# EAGLE design operator_mk2 (EAGLE 7.1.0)
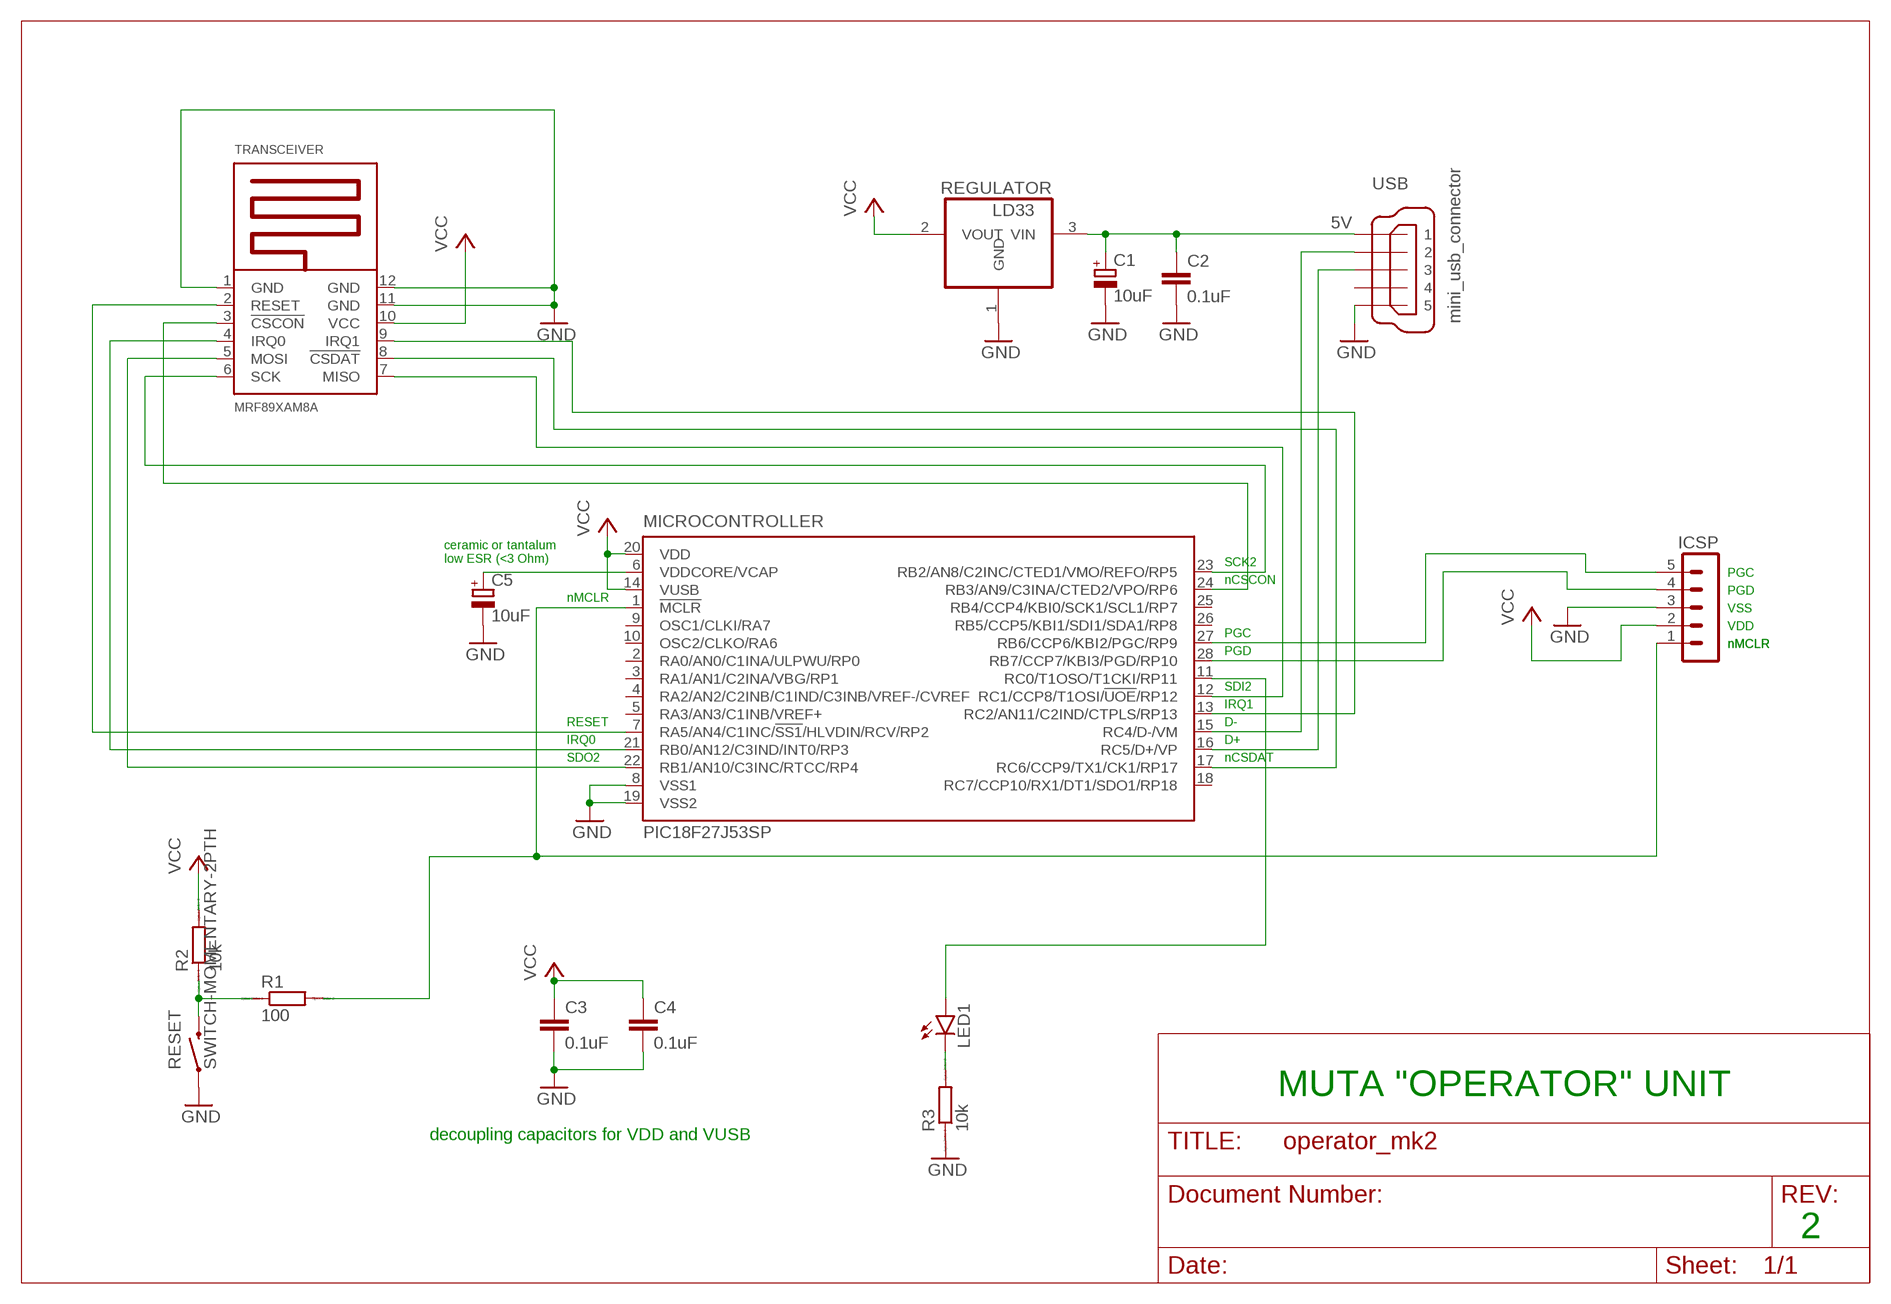
[diagram p0: schematic, sheet 1]

## Parts
C1  10uF  CPOL-EUTT6D6  [TT5D6]
C2  0.1uF  C-EU050-025X075  [C050-025X075]
C3  0.1uF  C-EU050-025X075  [C050-025X075]
C4  0.1uF  C-EU050-025X075  [C050-025X075]
C5  10uF  CPOL-EUC/6032-28R  [C/6032-28R]
ICSP  MA05-1  [MA05-1]
LED1  LED5MM  [LED5MM]
MICROCONTROLLER  PIC18F27J53SP  [DIL28-3]
R1  100  R-EU_0207_10  [0207/10]
R2  10k  R-EU_0207_10  [0207/10]
R3  10k  R-EU_0207_2V  [0207/2V]
REGULATOR  LD33  REG1117  [SOT223]
RESET  SWITCH-MOMENTARY-2PTH  [TACTILE-PTH]
TRANSCEIVER  MRF89XAM8A  [MRF89XAMXA]
USB  mini_usb_connector  MINI-USB-UX60-MB-5ST  [UX60-MB-5ST]

## Nets
5V: C1.+ C2.1 REGULATOR.3(VIN) USB.1
GND: C1.- C2.2 C3.2 C4.2 C5.- ICSP.3 MICROCONTROLLER.8(VSS1) MICROCONTROLLER.19(VSS2) R3.1 REGULATOR.1(GND) RESET.1 TRANSCEIVER.1(GND) TRANSCEIVER.11(GND) TRANSCEIVER.12(GND) USB.5
N$1: MICROCONTROLLER.15(RC4/D-/VM) USB.2
N$2: MICROCONTROLLER.16(RC5/D+/VP) USB.3
N$3: ICSP.1 MICROCONTROLLER.1(!MCLR) R1.2
N$4: C5.+ MICROCONTROLLER.6(VDDCORE/VCAP)
N$5: R1.1 R2.1 RESET.3
N$6: ICSP.4 MICROCONTROLLER.28(RB7/CCP7/KBI3/PGD/RP10)
N$7: ICSP.5 MICROCONTROLLER.27(RB6/CCP6/KBI2/PGC/RP9)
N$9: MICROCONTROLLER.7(RA5/AN4/C1INC/!SS1!/HLVDIN/RCV/RP2) TRANSCEIVER.2(RESET)
N$10: MICROCONTROLLER.23(RB2/AN8/C2INC/CTED1/VMO/REFO/RP5) TRANSCEIVER.6(SCK)
N$14: LED1.K(C) R3.2
N$15: LED1.A MICROCONTROLLER.11(RC0/T1OSO/T1CKI/RP11)
N$19: MICROCONTROLLER.12(RC1/CCP8/T1OSI/!UOE!/RP12) TRANSCEIVER.7(MISO)
N$21: MICROCONTROLLER.24(RB3/AN9/C3INA/CTED2/VPO/RP6) TRANSCEIVER.3(!CSCON)
N$22: MICROCONTROLLER.22(RB1/AN10/C3INC/RTCC/RP4) TRANSCEIVER.5(MOSI)
N$23: MICROCONTROLLER.21(RB0/AN12/C3IND/INT0/RP3) TRANSCEIVER.4(IRQ0)
N$24: MICROCONTROLLER.13(RC2/AN11/C2IND/CTPLS/RP13) TRANSCEIVER.9(IRQ1)
N$25: MICROCONTROLLER.17(RC6/CCP9/TX1/CK1/RP17) TRANSCEIVER.8(!CSDAT)
VCC: C3.1 C4.1 ICSP.2 MICROCONTROLLER.14(VUSB) MICROCONTROLLER.20(VDD) R2.2 REGULATOR.2(VOUT) TRANSCEIVER.10(VCC)
Unconnected: MICROCONTROLLER.2(RA0/AN0/C1INA/ULPWU/RP0) MICROCONTROLLER.3(RA1/AN1/C2INA/VBG/RP1) MICROCONTROLLER.4(RA2/AN2/C2INB/C1IND/C3INB/VREF-/CVREF) MICROCONTROLLER.5(RA3/AN3/C1INB/VREF+) MICROCONTROLLER.9(OSC1/CLKI/RA7) MICROCONTROLLER.10(OSC2/CLKO/RA6) MICROCONTROLLER.18(RC7/CCP10/RX1/DT1/SDO1/RP18) MICROCONTROLLER.25(RB4/CCP4/KBI0/SCK1/SCL1/RP7) MICROCONTROLLER.26(RB5/CCP5/KBI1/SDI1/SDA1/RP8) USB.4

## Notes on the sheet
- ceramic or tantalum
  low ESR (<3 Ohm)
- SCK2
- PGC
- nCSCON
- PGD
- nMCLR
- VSS
- VDD
- PGC
- nMCLR | nMCLR
- PGD
- SDI2
- IRQ1
- RESET | D-
- IRQ0 | D+
- SDO2 | nCSDAT
- MUTA "OPERATOR" UNIT
- decoupling capacitors for VDD and VUSB
- 2

## Library data of the parts
C1 C5 = resistor:CPOL-EU: POLARIZED CAPACITOR, European symbol
C2-C4 = rcl:C-EU: CAPACITOR, European symbol
ICSP = con-lstb:MA05-1: PIN HEADER; OC_FARNELL: unknown; OC_NEWARK: unknown
LED1 = SparkFun-LED:LED: LEDs Standard schematic elements and footprints for 5mm, 3mm, 1206, and 0603 sized LEDs. 5mm - Spark Fun Electronics SKU : COM-00529 (and others)
MICROCONTROLLER = microchip:PIC18F2*J53: PIC18F47J53 Family High-Performance USB Microcontrollers with nanoWatt XLP Technology Source: Data sheet <http://ww1.microchip.com/downloads/en/DeviceDoc/39964B.pdf>; MPN: PIC18F27J53-I/SP; OC_FARNELL: unknown; OC_NEWARK: 63R7839
R1-R3 = resistor:R-EU_: RESISTOR, European symbol; SPICEPREFIX: R
REGULATOR = burr-brown:REG1117: 800mA and 1A Low Dropout (LDO) Positive Regulator 1.8V, 2.5V, 2.85V, 3.3V, 5V, and Adj; MPN: LD33; OC_FARNELL: 1097566; OC_NEWARK: 14P6981
RESET = SparkFun-Electromechanical:SWITCH-MOMENTARY-2: Various NO switches- pushbuttons, reed, etc
TRANSCEIVER = microchip2:MRF89XAM8A: Microchip MRF89XAM8A 868MHz Module
USB = con-hirose:MINI-USB-: MINI USB Connector Source: http://www.hirose.co.jp/cataloge_hp/e24000019.pdf; OC_FARNELL: unknown; OC_NEWARK: unknown

## Board
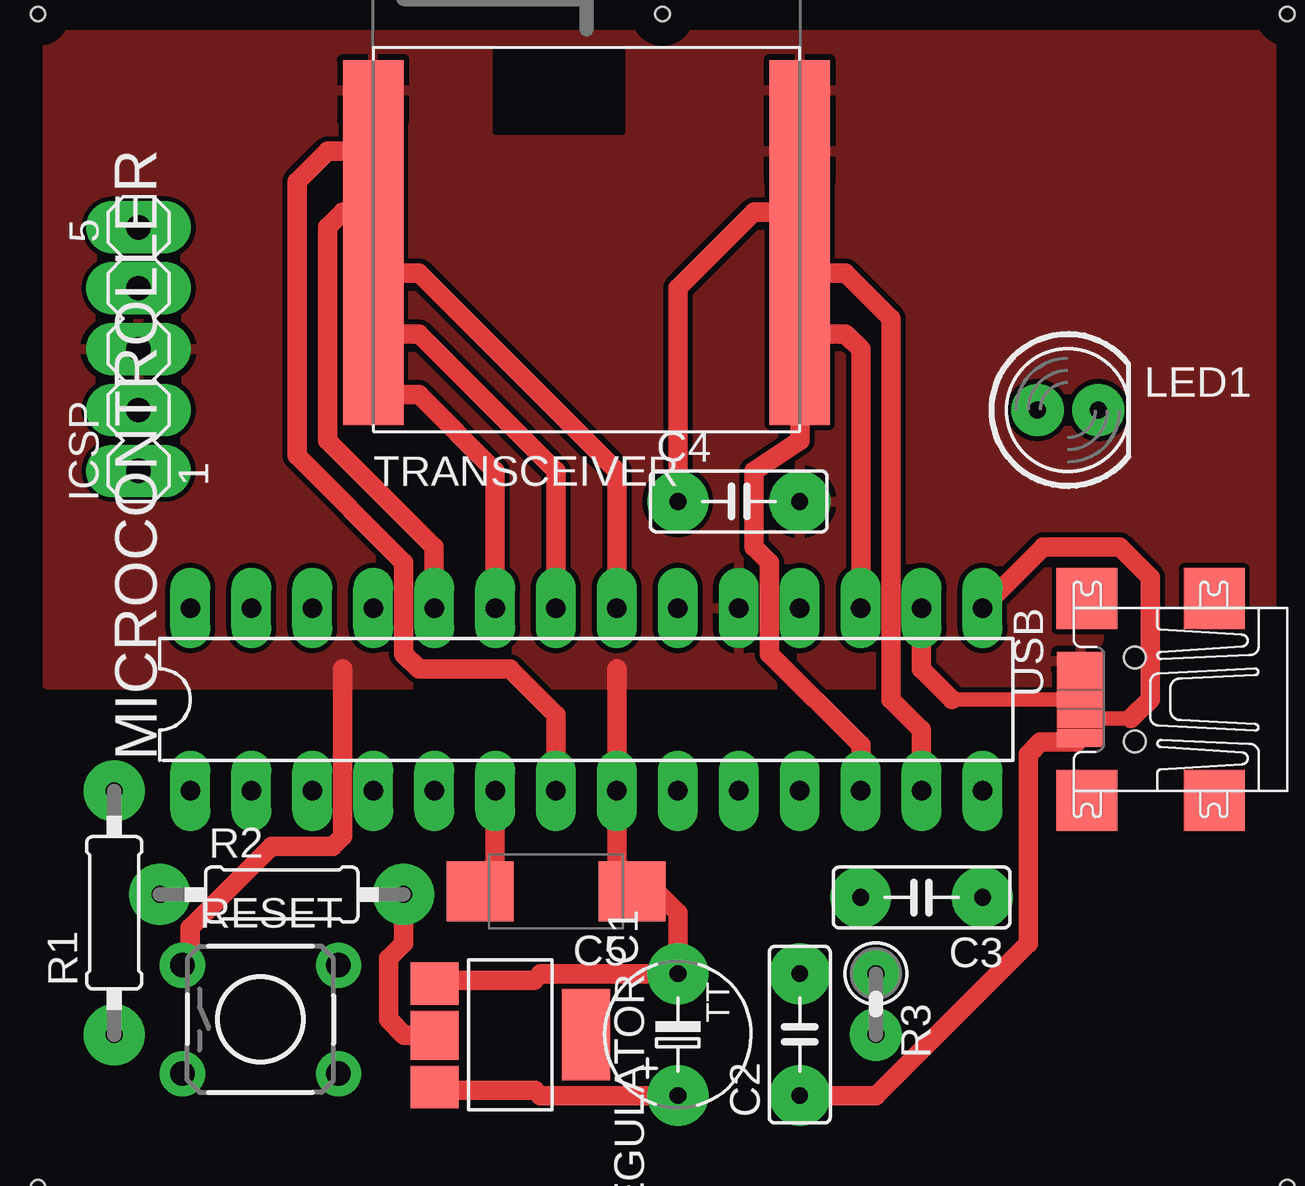
[diagram p1: board, top side]
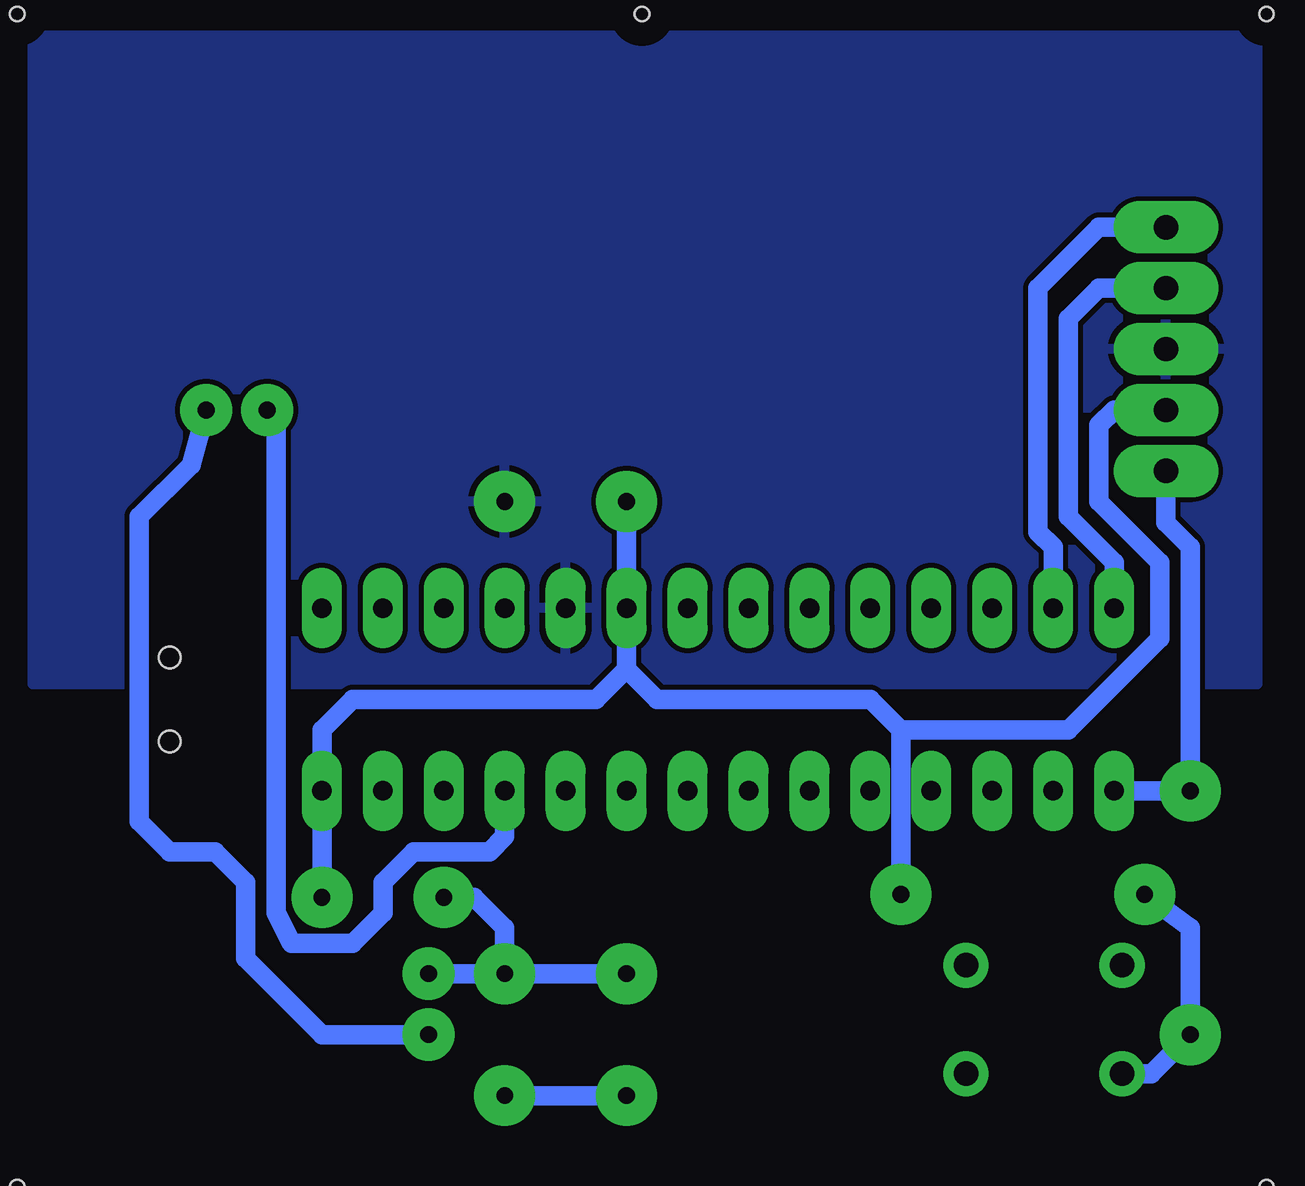
[diagram p2: board, bottom side, seen from below]

No outline drawn. Coordinates in mm, seen from the top.
Copper layers (1*16): Top 0.035mm / dielectric 1.5mm / Bottom 0.035mm
Design rules "default *": minimum track width 10mil, minimum drill 24mil, track to track 8mil, track to pad 8mil, pad to pad 8mil, via to via 8mil, smd to smd 8mil, copper to edge 40mil, drill to drill 8mil, minimum pad ring 10mil, minimum via ring 8mil, stop-mask expansion 4mil, vias tented up to drill 0mil, thermal gap 10mil
Holes 0.6 mm at 14.61,59.05 14.61,10.16 66.67,10.16 66.67,59.05 40.64,59.05

### Footprints (pad centres in the part's own frame; a part is rotated, then mirrored left to right if it is on the bottom)
TT5D6 = drill 0.7 pad 2.54: + -2.54,0; - 2.54,0
C050-025X075 = drill 0.7 pad 2.54: 1 -2.54,0; 2 2.54,0
C/6032-28R = smd 2.794 x 2.5: + 3.16,0; - -3.16,0
MA05-1 = drill 1.016 pad 2.184 long: 1 -5.08,0; 2 -2.54,0; 3 0,0; 4 2.54,0; 5 5.08,0
LED5MM = drill 0.7 pad 2.184: A -1.27,0; K 1.27,0
DIL28-3 = drill 0.813 pad 1.676 long: 1 -16.51,-3.81; 2 -13.97,-3.81; 3 -11.43,-3.81; 4 -8.89,-3.81; 5 -6.35,-3.81; 6 -3.81,-3.81; 7 -1.27,-3.81; 8 1.27,-3.81; 9 3.81,-3.81; 10 6.35,-3.81; 11 8.89,-3.81; 12 11.43,-3.81; 13 13.97,-3.81; 14 16.51,-3.81; 15 16.51,3.81; 16 13.97,3.81; 17 11.43,3.81; 18 8.89,3.81; 19 6.35,3.81; 20 3.81,3.81; 21 1.27,3.81; 22 -1.27,3.81; 23 -3.81,3.81; 24 -6.35,3.81; 25 -8.89,3.81; 26 -11.43,3.81; 27 -13.97,3.81; 28 -16.51,3.81
0207/10 = drill 0.7 pad 2.54: 1 -5.08,0; 2 5.08,0
0207/2V = drill 0.7 pad 2.184: 1 -1.27,0; 2 1.27,0
SOT223 = smd 1.499 x 2.007: 1 -2.261,-3.15; 2 0.025,-3.15; 3 2.311,-3.15 | smd 3.81 x 2.007: 4 0,3.15 | smd 0.508 x 2.007: 5 -0.741,-3.15; 6 -1.501,-3.15; 7 -1.501,-3.15; 8 -1.501,-3.15; 9 0.799,-3.15; 10 1.559,-3.15
TACTILE-PTH = drill 1.016 pad 1.88: 1 -3.251,2.261; 2 3.251,2.261; 3 -3.251,-2.261; 4 3.251,-2.261
MRF89XAMXA = smd 2.515 x 2.515: 1 -8.89,-1.27; 2 -8.89,-3.81; 3 -8.89,-6.35; 4 -8.89,-8.89; 5 -8.89,-11.43; 6 -8.89,-13.97; 7 8.89,-13.97; 8 8.89,-11.43; 9 8.89,-8.89; 10 8.89,-6.35; 11 8.89,-3.81; 12 8.89,-1.27
UX60-MB-5ST = smd 2 x 0.762: 1 2.25,1.6; 2 2.25,0.8; 3 2.25,0; 4 2.25,-0.8; 5 2.25,-1.6 | smd 2.54 x 2.54: M1 -3.3,-4.2; M2 -3.3,4.2; M3 2,4.2; M4 2,-4.2 | hole 0.9: 0,-1.75; 0,1.75

### Placement (x,y rotation side)
C1  41.27,16.51 90 top
C2  46.35,16.51 90 top
C3  51.44,22.23 180 top
C4  43.81,38.73 0 top
C5  36.2,22.48 180 top
ICSP  18.8,45.09 90 top
LED1  57.53,42.55 0 top
MICROCONTROLLER  37.47,30.48 0 top
R1  17.78,21.59 90 top
R2  24.77,22.35 0 top
R3  49.53,17.78 270 top
REGULATOR  34.29,16.51 270 top
RESET  23.88,17.14 0 top
TRANSCEIVER  37.47,57.15 0 top
USB  60.33,30.48 180 top

### Tracks (layer width: path | path; a pad name or v marks a point on that pad's centre or on a via)
5V
  Top 0.61: 57.9,28.7 USB.1
  Top 0.813: REGULATOR.3 35.33,14.2 35.56,13.97 C1.+ | 57.9,28.7 56.39,28.7 55.88,28.19 55.88,20.32 49.53,13.97 C2.1
  Bottom 0.813: C1.+ C2.1
GND
  Top 0.813: REGULATOR.1 35.28,18.77 35.56,19.05 C1.- 41.27,21.59 39.75,23.11 C5.- 38.73,23.73 MICROCONTROLLER.8 38.73,31.75 | 27.3,31.75 27.3,24.77 26.89,24.35 24.35,24.35 20.95,20.95 20.95,19.74 RESET.1
  Bottom 0.813: C1.- C2.2 | C2.2 R3.1 | C3.2 47.62,22.23 46.35,20.95 C2.2
  pour Bottom (isolate 0.025): 14.99,58.17 14.99,31.11 66.04,31.11 66.04,58.17
  pour Top (isolate 0.025): 14.99,58.17 14.99,31.11 66.04,31.11 66.04,58.17
N$1
  Top 0.61: USB.2 60.16,29.68
  Top 0.813: 60.16,29.68 60.96,30.48 60.96,35.56 59.69,36.83 56.52,36.83 MICROCONTROLLER.15
N$2
  Top 0.61: 52.7,30.48 USB.3
  Top 0.813: MICROCONTROLLER.16 51.44,31.75 52.7,30.48
N$3
  Bottom 0.813: ICSP.1 18.8,37.85 17.78,36.83 R1.2 MICROCONTROLLER.1
N$4
  Top 0.813: MICROCONTROLLER.6 33.66,23.73 C5.+
N$5
  Bottom 0.813: RESET.3 19.41,14.88 R1.1 17.78,20.95 R2.1
N$6
  Bottom 0.813: MICROCONTROLLER.28 20.95,36.2 22.86,38.1 22.86,46.35 21.59,47.62 ICSP.4
N$7
  Bottom 0.813: ICSP.5 21.59,50.16 24.13,47.62 24.13,37.47 23.5,36.83 MICROCONTROLLER.27
N$9
  Top 0.813: TRANSCEIVER.2 26.67,53.34 25.4,52.07 25.4,40.64 29.84,36.2 29.84,32.38 30.48,31.75 34.29,31.75 36.2,29.84 MICROCONTROLLER.7
N$10
  Top 0.813: MICROCONTROLLER.23 33.66,40.01 30.48,43.18 TRANSCEIVER.6
N$14
  Bottom 0.813: LED1.K 59.44,40.26 61.59,38.1 61.59,25.4 60.33,24.13 58.42,24.13 57.15,22.86 57.15,19.68 53.98,16.51 R3.2
N$15
  Bottom 0.813: MICROCONTROLLER.11 46.35,24.77 46.99,24.13 50.16,24.13 51.44,22.86 51.44,21.59 52.7,20.32 55.24,20.32 55.88,21.59 55.88,42.16 LED1.A
N$19
  Top 0.813: TRANSCEIVER.7 46.35,41.27 44.45,40.01 44.45,36.83 45.09,36.2 45.09,32.38 48.9,28.57 MICROCONTROLLER.12
N$21
  Top 0.813: MICROCONTROLLER.24 31.11,36.83 26.67,41.27 26.67,50.16 27.3,50.8 TRANSCEIVER.3
N$22
  Top 0.813: TRANSCEIVER.5 30.48,45.72 36.2,40.01 MICROCONTROLLER.22
N$23
  Top 0.813: TRANSCEIVER.4 30.48,48.26 38.73,40.01 MICROCONTROLLER.21
N$24
  Top 0.813: TRANSCEIVER.9 48.26,48.26 50.16,46.35 50.16,30.48 51.44,29.21 MICROCONTROLLER.13
N$25
  Top 0.813: MICROCONTROLLER.17 48.9,45.09 48.26,45.72 TRANSCEIVER.8
VCC
  Top 0.813: TRANSCEIVER.10 44.45,50.8 41.27,47.62 C4.1 | REGULATOR.2 29.87,16.48 29.21,17.14 29.21,19.68 29.84,20.32 R2.2
  Bottom 0.813: C4.1 MICROCONTROLLER.20 41.27,31.75 | C3.1 MICROCONTROLLER.14 53.98,29.21 52.7,30.48 42.55,30.48 41.27,31.75 | 41.27,31.75 40.01,30.48 31.11,30.48 29.84,29.21 | 29.84,29.21 R2.2 | 29.84,29.21 22.86,29.21 19.05,33.02 19.05,36.2 21.59,38.73 21.59,41.91 20.95,42.55 ICSP.2